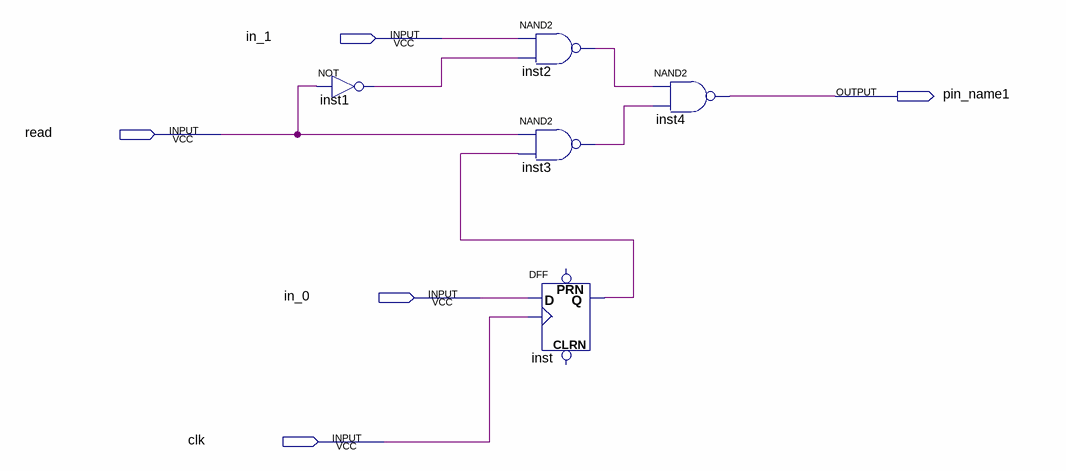
[diagram p0: schematic sheet]
// Quartus schematic memD.bdf as structural Verilog: 5 symbols, 5 pins
module memD (
  input  in_1,
  input  read,
  input  in_0,
  input  clk,
  output pin_name1
);

  wire inst1_out, inst2_out, inst3_out, inst_q;

  not inst1 (inst1_out, read);
  nand inst2 (inst2_out, in_1, inst1_out);
  nand inst3 (inst3_out, read, inst_q);
  DFF inst (.CLK(clk), .D(in_0), .Q(inst_q));  // open: CLRN, PRN
  nand inst4 (pin_name1, inst2_out, inst3_out);
endmodule
